# EAGLE schematic v_reg (EAGLE 8.5.0)
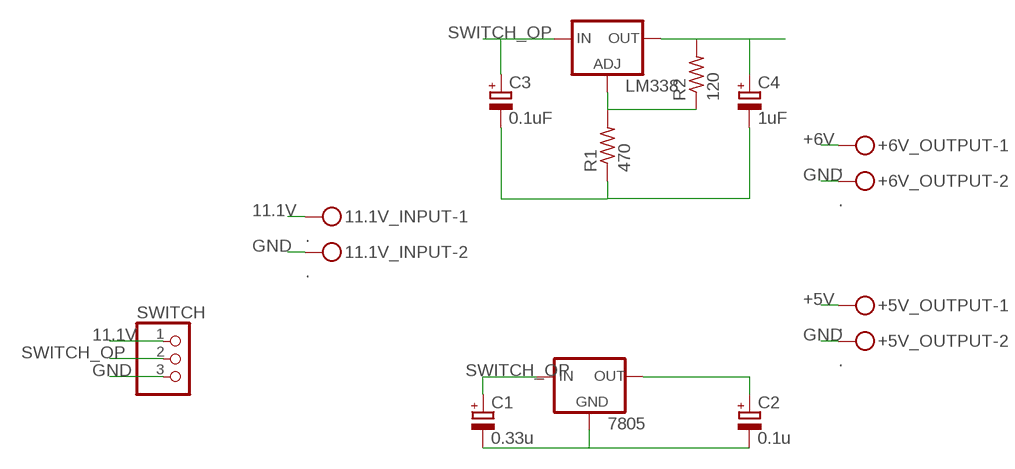
[diagram p0: schematic, sheet 1]

## Parts
11.1V_INPUT  .  MKDSN1,5/2-5,08  [MKDSN1,5/2-5,08]
7805  78XXS  [78XXS]
+5V_OUTPUT  .  MKDSN1,5/2-5,08  [MKDSN1,5/2-5,08]
+6V_OUTPUT  .  MKDSN1,5/2-5,08  [MKDSN1,5/2-5,08]
C1  0.33u  CPOL-EUE1.8-4  [E1,8-4]
C2  0.1u  CPOL-EUE1.8-4  [E1,8-4]
C3  0.1uF  CPOL-EUE1.8-4  [E1,8-4]
C4  1uF  CPOL-EUE1.8-4  [E1,8-4]
LM338  LM138-TS  [TO220S]
R1  470  R-US_0309/10  [0309/10]
R2  120  R-US_0309/10  [0309/10]
SWITCH  PINHD-1X3  [1X03]

## Nets
11.1V: 11.1V_INPUT.1 SWITCH.1
+5V: 7805.OUT +5V_OUTPUT.1 C2.+
+6V: +6V_OUTPUT.1 C4.+ LM338.2(OUT) R2.2
GND: 11.1V_INPUT.2 7805.GND +5V_OUTPUT.2 +6V_OUTPUT.2 C1.- C2.- C3.- C4.- R1.1 SWITCH.3
N$2: LM338.1(ADJ) R1.2 R2.1
SWITCH_OP: 7805.IN C1.+ C3.+ LM338.3(IN) SWITCH.2

## Library data of the parts
11.1V_INPUT +5V_OUTPUT +6V_OUTPUT = con-phoenix-508:MKDSN1,5/2-5,08: MKDSN 1,5/ 2-5,08 Printklemme Nennstrom: 13,5 A Nennspannung: 250 V Rastermaß: 5,08 mm Polzahl: 2 Anschlussart: Schraubanschluss Montage: Löten Anschlussrichtung Leiter/Platine: 0 ° Artikelnummer: 1729128 Source: http://eshop.phoenixcontact.com .. 1729128.pdf
7805 = v-reg:78XXS: VOLTAGE REGULATOR
C1-C4 = resistor:CPOL-EU: POLARIZED CAPACITOR, European symbol
LM338 = v-reg:LM138-TS: VOLTAGE REGULATOR
R1 R2 = resistor:R-US_: RESISTOR, American symbol
SWITCH = pinhead:PINHD-1X3: PIN HEADER